# EAGLE schematic dual-spi-interface (EAGLE 6.5.0)
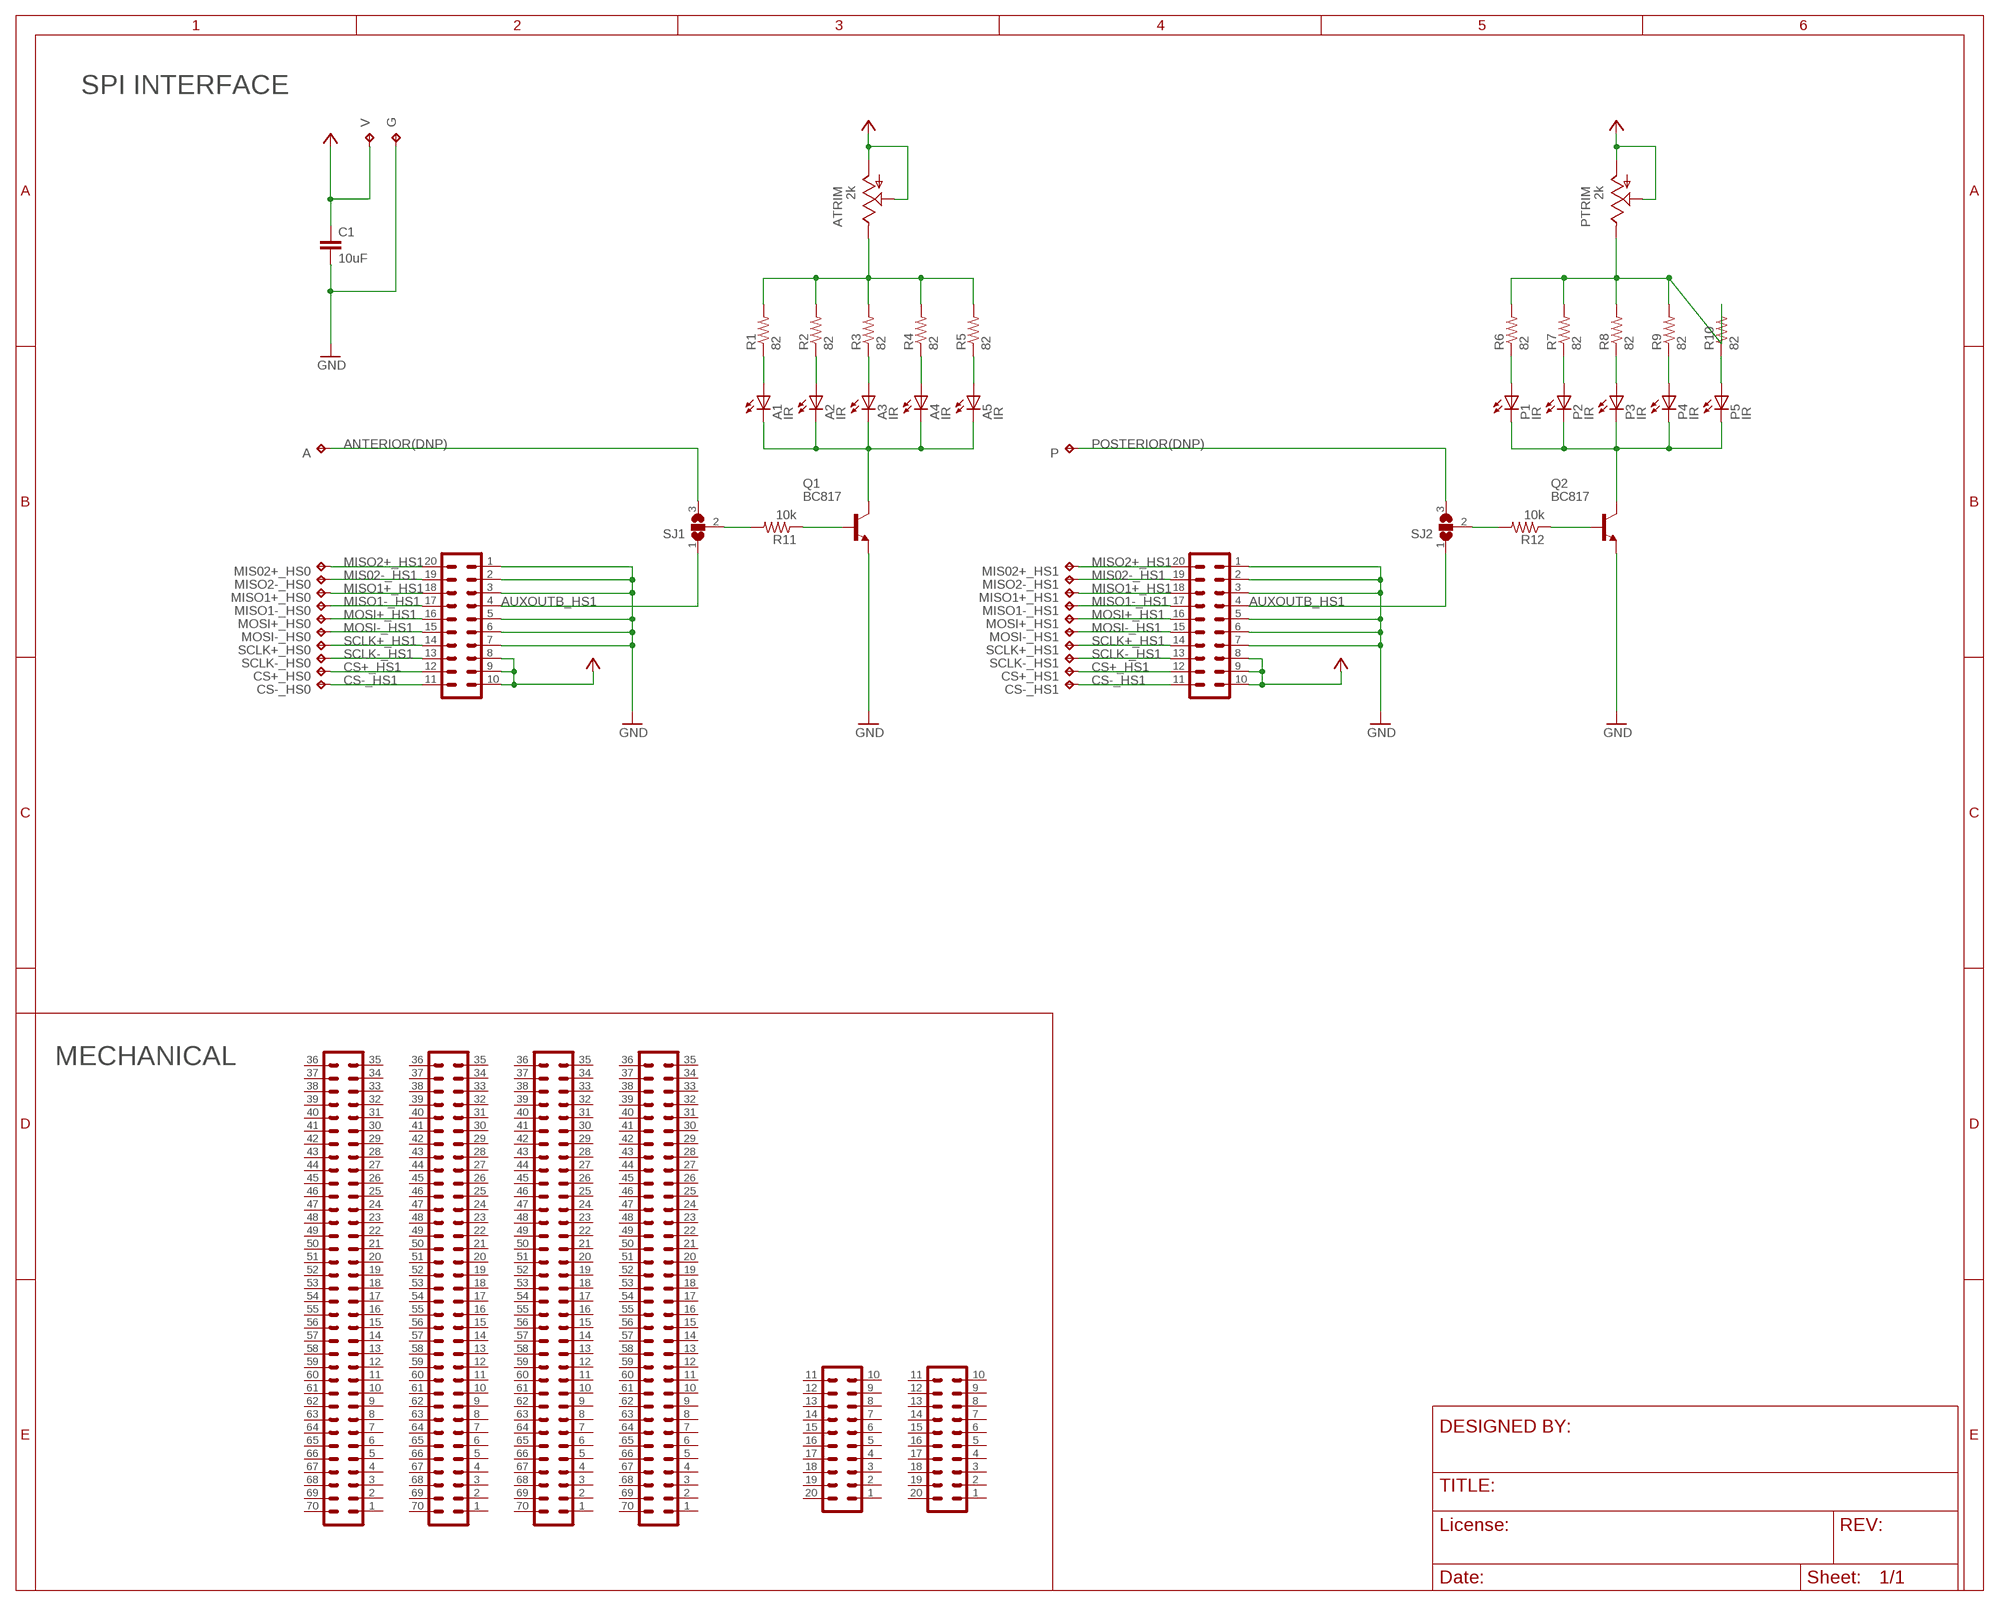
[diagram p0: schematic, sheet 1]

## Parts
A  TP_01  [TP01]
A1  IR  LED_0603  [LED-0603]
A2  IR  LED_0603  [LED-0603]
A3  IR  LED_0603  [LED-0603]
A4  IR  LED_0603  [LED-0603]
A5  IR  LED_0603  [LED-0603]
ATRIM  2k  TRIM_EIA/EIAJ  [EIA/EIAJ]
C1  10uF  C_0805  [0805]
CS+_HS0  TP_01  [TP01]
CS+_HS1  TP_01  [TP01]
CS-_HS0  TP_01  [TP01]
CS-_HS1  TP_01  [TP01]
G  TP_02  [TP02]
HS1  JMD20-V  PINHD-2X10_DF40-20REC  [DF40-20REC]
HS2  JMD20-V  PINHD-2X10_DF40-20REC  [DF40-20REC]
MIS02+_HS0  TP_01  [TP01]
MIS02+_HS1  TP_01  [TP01]
MISO1+_HS0  TP_01  [TP01]
MISO1+_HS1  TP_01  [TP01]
MISO1-_HS0  TP_01  [TP01]
MISO1-_HS1  TP_01  [TP01]
MISO2-_HS0  TP_01  [TP01]
MISO2-_HS1  TP_01  [TP01]
MOSI+_HS0  TP_01  [TP01]
MOSI+_HS1  TP_01  [TP01]
MOSI-_HS0  TP_01  [TP01]
MOSI-_HS1  TP_01  [TP01]
P  TP_01  [TP01]
P1  IR  LED_0603  [LED-0603]
P2  IR  LED_0603  [LED-0603]
P3  IR  LED_0603  [LED-0603]
P4  IR  LED_0603  [LED-0603]
P5  IR  LED_0603  [LED-0603]
PTRIM  2k  TRIM_EIA/EIAJ  [EIA/EIAJ]
Q1  BC817  BC817-16SMD  [SOT23-BEC]
Q2  BC817  BC817-16SMD  [SOT23-BEC]
R1  82  R_0402  [0402]
R2  82  R_0402  [0402]
R3  82  R_0402  [0402]
R4  82  R_0402  [0402]
R5  82  R_0402  [0402]
R6  82  R_0402  [0402]
R7  82  R_0402  [0402]
R8  82  R_0402  [0402]
R9  82  R_0402  [0402]
R10  82  R_0402  [0402]
R11  10k  R_0402  [0402]
R12  10k  R_0402  [0402]
SCLK+_HS0  TP_01  [TP01]
SCLK+_HS1  TP_01  [TP01]
SCLK-_HS0  TP_01  [TP01]
SCLK-_HS1  TP_01  [TP01]
SJ1  SJ2W  [SJ_2]
SJ2  SJ2W  [SJ_2]
U$2  PINHD-2X10_DF40-20REC  [DF40-20REC]
U$3  PINHD-2X10_DF40-20REC  [DF40-20REC]
U$4  PINHD-2X35_DF40REC  [DF40-70REC]
U$5  PINHD-2X35_DF40REC  [DF40-70REC]
U$6  PINHD-2X35_DF40REC  [DF40-70REC]
U$7  PINHD-2X35_DF40REC  [DF40-70REC]
V  TP_02  [TP02]

## Nets
ANTERIOR(DNP): A.TP SJ1.3
AUXOUT_A2: SJ2.1
AUXOUTB_HS1: HS1.4 HS2.4 SJ1.1
B2: P1.C P2.C P3.C P4.C P5.C Q2.C
CS+_HS1: CS+_HS0.TP CS+_HS1.TP HS1.12 HS2.12
CS-_HS1: CS-_HS0.TP CS-_HS1.TP HS1.11 HS2.11
F1: A1.C A2.C A3.C A4.C A5.C Q1.C
GND: C1.2 G.TP HS1.1 HS1.2 HS1.3 HS1.5 HS1.6 HS1.7 HS2.1 HS2.2 HS2.3 HS2.5 HS2.6 HS2.7 Q1.E Q2.E
MIS02-_HS1: HS1.19 HS2.19 MISO2-_HS0.TP MISO2-_HS1.TP
MISO1+_HS1: HS1.18 HS2.18 MISO1+_HS0.TP MISO1+_HS1.TP
MISO1-_HS1: HS1.17 HS2.17 MISO1-_HS0.TP MISO1-_HS1.TP
MISO2+_HS1: HS1.20 HS2.20 MIS02+_HS0.TP MIS02+_HS1.TP
MOSI+_HS1: HS1.16 HS2.16 MOSI+_HS0.TP MOSI+_HS1.TP
MOSI-_HS1: HS1.15 HS2.15 MOSI-_HS0.TP MOSI-_HS1.TP
N$1: ATRIM.E R1.2 R2.2 R3.2 R4.2 R5.2
N$2: P1.A R6.1
N$3: A1.A R1.1
N$4: R12.2 SJ2.2
N$5: Q2.B R12.1
N$6: PTRIM.E R6.2 R7.2 R8.2 R9.2 R10.2
N$8: A2.A R2.1
N$9: A3.A R3.1
N$10: A4.A R4.1
N$11: A5.A R5.1
N$12: P2.A R7.1
N$13: P3.A R8.1
N$14: P4.A R9.1
N$15: P5.A R10.1
N$28: Q1.B R11.1
N$34: R11.2 SJ1.2
POSTERIOR(DNP): P.TP SJ2.3
SCLK+_HS1: HS1.14 HS2.14 SCLK+_HS0.TP SCLK+_HS1.TP
SCLK-_HS1: HS1.13 HS2.13 SCLK-_HS0.TP SCLK-_HS1.TP
VDD: ATRIM.A ATRIM.S C1.1 HS1.8 HS1.9 HS1.10 HS2.8 HS2.9 HS2.10 PTRIM.A PTRIM.S V.TP ; supply symbol labelled VCC
Unconnected: U$2.1 U$2.2 U$2.3 U$2.4 U$2.5 U$2.6 U$2.7 U$2.8 U$2.9 U$2.10 U$2.11 U$2.12 U$2.13 U$2.14 U$2.15 U$2.16 U$2.17 U$2.18 U$2.19 U$2.20 U$3.1 U$3.2 U$3.3 U$3.4 U$3.5 U$3.6 U$3.7 U$3.8 U$3.9 U$3.10 U$3.11 U$3.12 U$3.13 U$3.14 U$3.15 U$3.16 U$3.17 U$3.18 U$3.19 U$3.20 U$4.1 U$4.2 U$4.3 U$4.4 U$4.5 U$4.6 U$4.7 U$4.8 U$4.9 U$4.10 U$4.11 U$4.12 U$4.13 U$4.14 U$4.15 U$4.16 U$4.17 U$4.18 U$4.19 U$4.20 U$4.21 U$4.22 U$4.23 U$4.24 U$4.25 U$4.26 U$4.27 U$4.28 U$4.29 U$4.30 U$4.31 U$4.32 U$4.33 U$4.34 U$4.35 U$4.36 U$4.37 U$4.38 U$4.39 U$4.40 U$4.41 U$4.42 U$4.43 U$4.44 U$4.45 U$4.46 U$4.47 U$4.48 U$4.49 U$4.50 U$4.51 U$4.52 U$4.53 U$4.54 U$4.55 U$4.56 U$4.57 U$4.58 U$4.59 U$4.60 U$4.61 U$4.62 U$4.63 U$4.64 U$4.65 U$4.66 U$4.67 U$4.68 U$4.69 U$4.70 U$5.1 U$5.2 U$5.3 U$5.4 U$5.5 U$5.6 U$5.7 U$5.8 U$5.9 U$5.10 U$5.11 U$5.12 U$5.13 U$5.14 U$5.15 U$5.16 U$5.17 U$5.18 U$5.19 U$5.20 U$5.21 U$5.22 U$5.23 U$5.24 U$5.25 U$5.26 U$5.27 U$5.28 U$5.29 U$5.30 U$5.31 U$5.32 U$5.33 U$5.34 U$5.35 U$5.36 U$5.37 U$5.38 U$5.39 U$5.40 U$5.41 U$5.42 U$5.43 U$5.44 U$5.45 U$5.46 U$5.47 U$5.48 U$5.49 U$5.50 U$5.51 U$5.52 U$5.53 U$5.54 U$5.55 U$5.56 U$5.57 U$5.58 U$5.59 U$5.60 U$5.61 U$5.62 U$5.63 U$5.64 U$5.65 U$5.66 U$5.67 U$5.68 U$5.69 U$5.70 U$6.1 U$6.2 U$6.3 U$6.4 U$6.5 U$6.6 U$6.7 U$6.8 U$6.9 U$6.10 U$6.11 U$6.12 U$6.13 U$6.14 U$6.15 U$6.16 U$6.17 U$6.18 U$6.19 U$6.20 U$6.21 U$6.22 U$6.23 U$6.24 U$6.25 U$6.26 U$6.27 U$6.28 U$6.29 U$6.30 U$6.31 U$6.32 U$6.33 U$6.34 U$6.35 U$6.36 U$6.37 U$6.38 U$6.39 U$6.40 U$6.41 U$6.42 U$6.43 U$6.44 U$6.45 U$6.46 U$6.47 U$6.48 U$6.49 U$6.50 U$6.51 U$6.52 U$6.53 U$6.54 U$6.55 U$6.56 U$6.57 U$6.58 U$6.59 U$6.60 U$6.61 U$6.62 U$6.63 U$6.64 U$6.65 U$6.66 U$6.67 U$6.68 U$6.69 U$6.70 U$7.1 U$7.2 U$7.3 U$7.4 U$7.5 U$7.6 U$7.7 U$7.8 U$7.9 U$7.10 U$7.11 U$7.12 U$7.13 U$7.14 U$7.15 U$7.16 U$7.17 U$7.18 U$7.19 U$7.20 U$7.21 U$7.22 U$7.23 U$7.24 U$7.25 U$7.26 U$7.27 U$7.28 U$7.29 U$7.30 U$7.31 U$7.32 U$7.33 U$7.34 U$7.35 U$7.36 U$7.37 U$7.38 U$7.39 U$7.40 U$7.41 U$7.42 U$7.43 U$7.44 U$7.45 U$7.46 U$7.47 U$7.48 U$7.49 U$7.50 U$7.51 U$7.52 U$7.53 U$7.54 U$7.55 U$7.56 U$7.57 U$7.58 U$7.59 U$7.60 U$7.61 U$7.62 U$7.63 U$7.64 U$7.65 U$7.66 U$7.67 U$7.68 U$7.69 U$7.70

## Notes on the sheet
- SPI INTERFACE
- MECHANICAL

## Library data of the parts
A CS+_HS0 CS+_HS1 CS-_HS0 CS-_HS1 G MIS02+_HS0 MIS02+_HS1 MISO1+_HS0 MISO1+_HS1 MISO1-_HS0 MISO1-_HS1 MISO2-_HS0 MISO2-_HS1 MOSI+_HS0 MOSI+_HS1 MOSI-_HS0 MOSI-_HS1 P SCLK+_HS0 SCLK+_HS1 SCLK-_HS0 SCLK-_HS1 V = headstage:TP
A1-A5 P1-P5 = cyclops:LED: Surface mount LED
ATRIM PTRIM = headstage:TRIM
C1 = headstage:C: Capacitor; MN: TDK Corp.; PARTNO: C2012X5R1Cxxxxxxx; VID: DK
HS1 HS2 U$2 U$3 = jonnew:PINHD-2X10
Q1 Q2 = cyclops:BC817*: NPN Transistor
R1-R12 = headstage:R: Resistor
SJ1 SJ2 = jumper:SJ2W: SMD solder JUMPER
U$4-U$7 = jonnew:PINHD-2X35